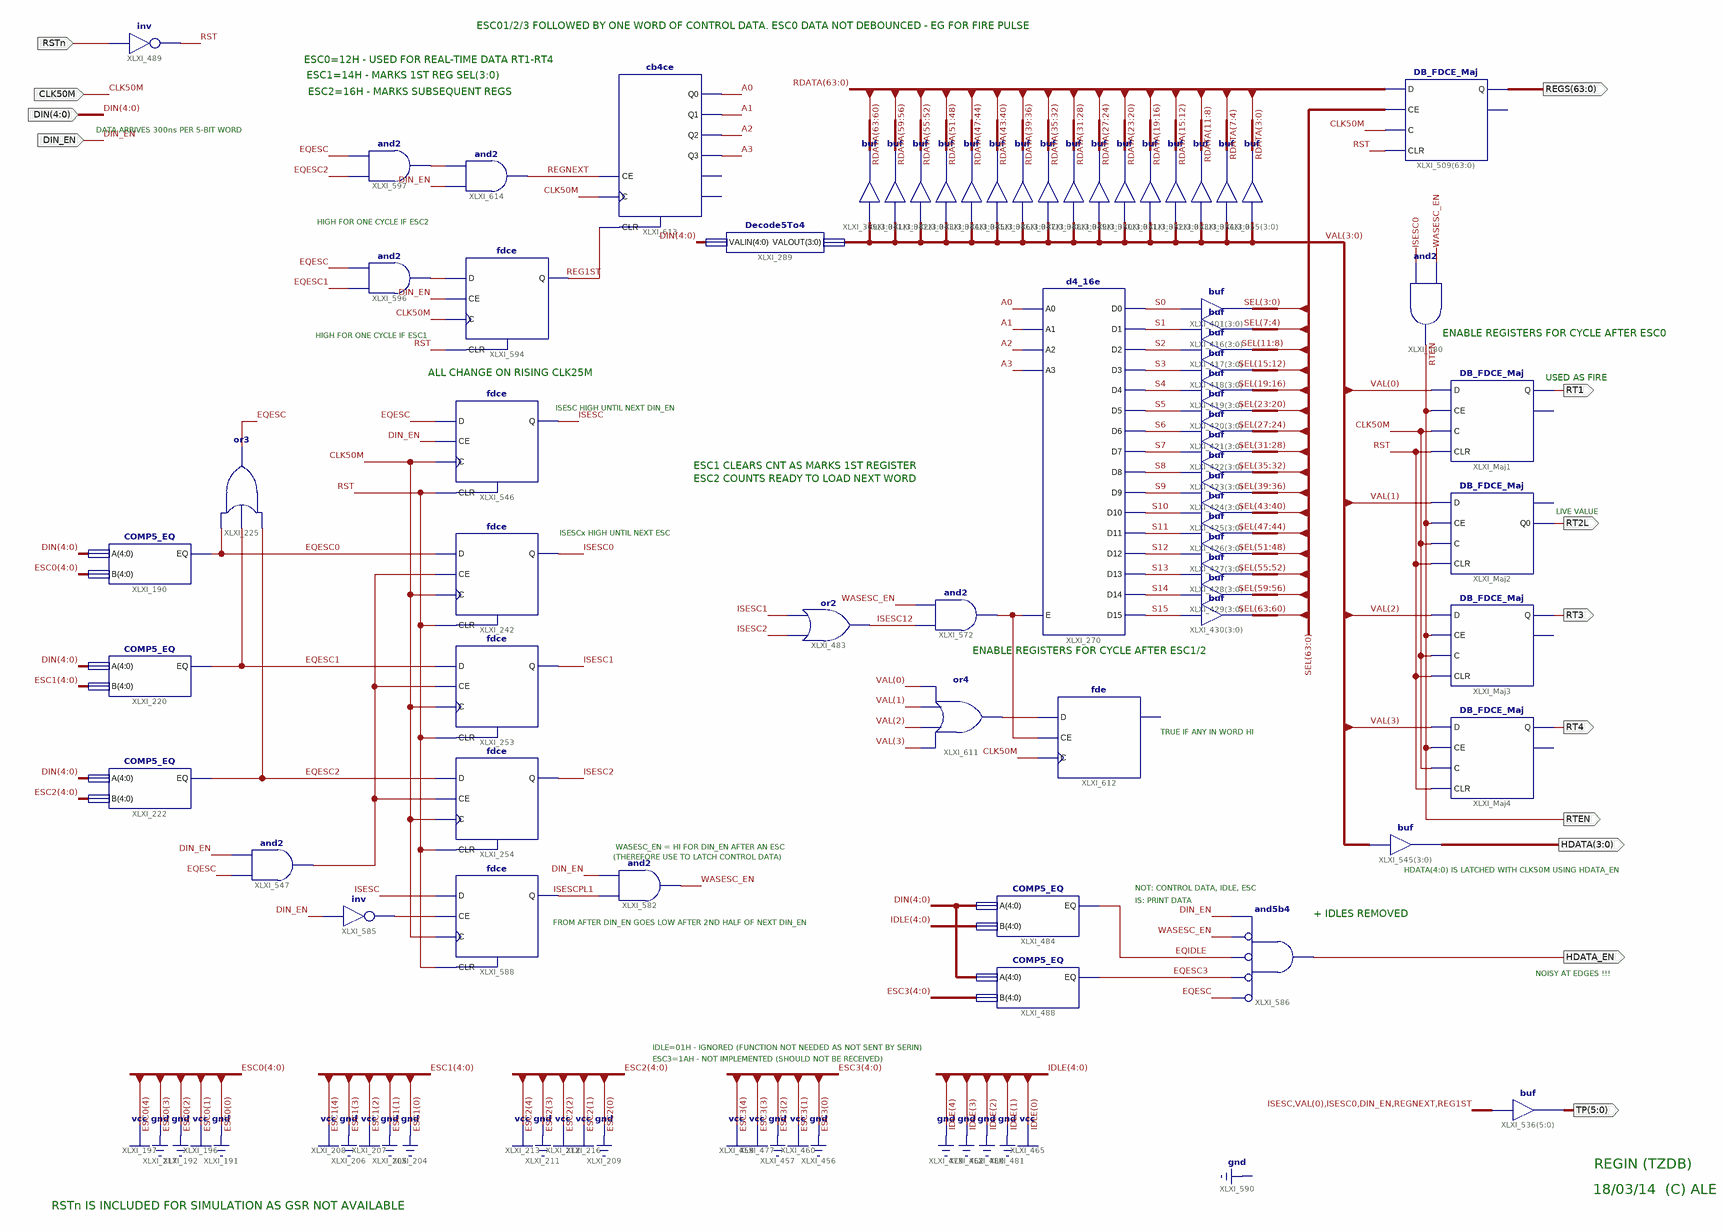
[diagram p0: schematic sheet 1]
// Xilinx ISE schematic DB_RegIn.sch (aspartan3e) as structural Verilog: 67 symbols, 13 ports
module DB_RegIn (
  input  CLK50M,
  input  [4:0] DIN,
  input  DIN_EN,
  input  RSTn,
  output [63:0] REGS,
  output RT1,
  output RT3,
  output RT4,
  output RTEN,
  output HDATA_EN,
  output [3:0] HDATA,
  output [5:0] TP,
  output RT2L
);

  wire A0, A1, A2, A3, EQESC, EQESC0, EQESC1, EQESC2, EQESC3, EQIDLE, ISESC, ISESC0, ISESC1, ISESC2, ISESC12,
       ISESCPL1, REG1ST, REGNEXT, RST, S0, S1, S2, S3, S4, S5, S6, S7, S8, S9, S10, S11, S12, S13, S14, S15,
       WASESC_EN, XLXN_833, XLXN_905, XLXN_906, XLXN_910, XLXN_955, XLXN_956;
  wire [3:0] VAL;
  wire [63:0] RDATA, SEL;

  COMP5_EQ XLXI_190 (.A(DIN), .B(5'b10010), .EQ(EQESC0));
  or XLXI_225 (EQESC, EQESC2, EQESC1, EQESC0);
  fdce XLXI_242 (.C(CLK50M), .CE(XLXN_833), .CLR(RST), .D(EQESC0), .Q(ISESC0));
  fdce XLXI_253 (.C(CLK50M), .CE(XLXN_833), .CLR(RST), .D(EQESC1), .Q(ISESC1));
  fdce XLXI_254 (.C(CLK50M), .CE(XLXN_833), .CLR(RST), .D(EQESC2), .Q(ISESC2));
  COMP5_EQ XLXI_220 (.A(DIN), .B(5'b10100), .EQ(EQESC1));
  COMP5_EQ XLXI_222 (.A(DIN), .B(5'b10110), .EQ(EQESC2));
  assign RDATA[63:60] = VAL;  // buf XLXI_309[3..0], 4 bits wide
  assign RDATA[59:56] = VAL;  // buf XLXI_341[3..0], 4 bits wide
  assign RDATA[55:52] = VAL;  // buf XLXI_342[3..0], 4 bits wide
  assign RDATA[51:48] = VAL;  // buf XLXI_343[3..0], 4 bits wide
  assign RDATA[47:44] = VAL;  // buf XLXI_344[3..0], 4 bits wide
  assign RDATA[43:40] = VAL;  // buf XLXI_345[3..0], 4 bits wide
  assign RDATA[39:36] = VAL;  // buf XLXI_346[3..0], 4 bits wide
  assign RDATA[35:32] = VAL;  // buf XLXI_347[3..0], 4 bits wide
  assign RDATA[31:28] = VAL;  // buf XLXI_348[3..0], 4 bits wide
  assign RDATA[27:24] = VAL;  // buf XLXI_349[3..0], 4 bits wide
  assign RDATA[23:20] = VAL;  // buf XLXI_350[3..0], 4 bits wide
  assign RDATA[19:16] = VAL;  // buf XLXI_351[3..0], 4 bits wide
  assign RDATA[15:12] = VAL;  // buf XLXI_352[3..0], 4 bits wide
  assign RDATA[11:8] = VAL;  // buf XLXI_353[3..0], 4 bits wide
  assign RDATA[7:4] = VAL;  // buf XLXI_354[3..0], 4 bits wide
  assign RDATA[3:0] = VAL;  // buf XLXI_355[3..0], 4 bits wide
  Decode5To4 XLXI_289 (.VALIN(DIN), .VALOUT(VAL));
  d4_16e XLXI_270 (
    .A0(A0), .A1(A1), .A2(A2), .A3(A3), .E(XLXN_955), .D0(S0), .D1(S1), .D10(S10), .D11(S11), .D12(S12),
    .D13(S13), .D14(S14), .D15(S15), .D2(S2), .D3(S3), .D4(S4), .D5(S5), .D6(S6), .D7(S7), .D8(S8), .D9(S9));
  assign SEL[3:0] = {4{S0}};  // buf XLXI_401[3..0], 4 bits wide
  assign SEL[7:4] = {4{S1}};  // buf XLXI_416[3..0], 4 bits wide
  assign SEL[11:8] = {4{S2}};  // buf XLXI_417[3..0], 4 bits wide
  assign SEL[15:12] = {4{S3}};  // buf XLXI_418[3..0], 4 bits wide
  assign SEL[19:16] = {4{S4}};  // buf XLXI_419[3..0], 4 bits wide
  assign SEL[23:20] = {4{S5}};  // buf XLXI_420[3..0], 4 bits wide
  assign SEL[27:24] = {4{S6}};  // buf XLXI_421[3..0], 4 bits wide
  assign SEL[31:28] = {4{S7}};  // buf XLXI_422[3..0], 4 bits wide
  assign SEL[35:32] = {4{S8}};  // buf XLXI_423[3..0], 4 bits wide
  assign SEL[39:36] = {4{S9}};  // buf XLXI_424[3..0], 4 bits wide
  assign SEL[43:40] = {4{S10}};  // buf XLXI_425[3..0], 4 bits wide
  assign SEL[47:44] = {4{S11}};  // buf XLXI_426[3..0], 4 bits wide
  assign SEL[51:48] = {4{S12}};  // buf XLXI_427[3..0], 4 bits wide
  assign SEL[55:52] = {4{S13}};  // buf XLXI_428[3..0], 4 bits wide
  assign SEL[59:56] = {4{S14}};  // buf XLXI_429[3..0], 4 bits wide
  assign SEL[63:60] = {4{S15}};  // buf XLXI_430[3..0], 4 bits wide
  DB_FDCE_Maj XLXI_Maj1 (.C(CLK50M), .CE(RTEN), .CLR(RST), .D(VAL[0]), .Q(RT1));  // open: Q0
  DB_FDCE_Maj XLXI_509[63:0] (.C(CLK50M), .CE(SEL), .CLR(RST), .D(RDATA), .Q(REGS));  // open: Q0
  DB_FDCE_Maj XLXI_Maj3 (.C(CLK50M), .CE(RTEN), .CLR(RST), .D(VAL[2]), .Q(RT3));  // open: Q0
  DB_FDCE_Maj XLXI_Maj4 (.C(CLK50M), .CE(RTEN), .CLR(RST), .D(VAL[3]), .Q(RT4));  // open: Q0
  assign HDATA = VAL;  // buf XLXI_545[3..0], 4 bits wide
  fdce XLXI_546 (.C(CLK50M), .CE(DIN_EN), .CLR(RST), .D(EQESC), .Q(ISESC));
  and XLXI_547 (XLXN_833, EQESC, DIN_EN);
  COMP5_EQ XLXI_484 (.A(DIN), .B(5'b00001), .EQ(EQIDLE));
  COMP5_EQ XLXI_488 (.A(DIN), .B(5'b11010), .EQ(EQESC3));
  assign TP = {ISESC, VAL[0], ISESC0, DIN_EN, REGNEXT, REG1ST};  // buf XLXI_536[5..0], 6 bits wide
  and XLXI_580 (RTEN, ISESC0, WASESC_EN);
  and XLXI_582 (WASESC_EN, ISESCPL1, DIN_EN);
  not XLXI_585 (XLXN_905, DIN_EN);
  and XLXI_586 (HDATA_EN, ~EQESC, ~EQESC3, ~EQIDLE, ~WASESC_EN, DIN_EN);  // and5b4
  fdce XLXI_588 (.C(CLK50M), .CE(XLXN_905), .CLR(RST), .D(ISESC), .Q(ISESCPL1));
  and XLXI_596 (XLXN_906, EQESC1, EQESC);
  fdce XLXI_594 (.C(CLK50M), .CE(DIN_EN), .CLR(RST), .D(XLXN_906), .Q(REG1ST));
  and XLXI_597 (XLXN_910, EQESC2, EQESC);
  and XLXI_572 (XLXN_955, ISESC12, WASESC_EN);
  or XLXI_483 (ISESC12, ISESC2, ISESC1);
  or XLXI_611 (XLXN_956, VAL[3], VAL[2], VAL[1], VAL[0]);
  fde XLXI_612 (.C(CLK50M), .CE(XLXN_955), .D(XLXN_956));  // open: Q
  not XLXI_489 (RST, RSTn);
  and XLXI_614 (REGNEXT, DIN_EN, XLXN_910);
  cb4ce XLXI_613 (.C(CLK50M), .CE(REGNEXT), .CLR(REG1ST), .Q0(A0), .Q1(A1), .Q2(A2), .Q3(A3));  // open: CEO, TC
  DB_FDCE_Maj XLXI_Maj2 (.C(CLK50M), .CE(RTEN), .CLR(RST), .D(VAL[1]), .Q0(RT2L));  // open: Q

  // Notes on the sheet:
  //   ESC01/2/3 FOLLOWED BY ONE WORD OF CONTROL DATA. ESC0 DATA NOT DEBOUNCED - EG FOR FIRE PULSE
  //   ESC0=12H - USED FOR REAL-TIME DATA RT1-RT4
  //   ESC1=14H - MARKS 1ST REG SEL(3:0)
  //   ESC2=16H - MARKS SUBSEQUENT REGS
  //   DATA ARRIVES 300ns PER 5-BIT WORD
  //   HIGH FOR ONE CYCLE IF ESC2
  //   ENABLE REGISTERS FOR CYCLE AFTER ESC0
  //   HIGH FOR ONE CYCLE IF ESC1
  //   ALL CHANGE ON RISING CLK25M
  //   USED AS FIRE
  //   ISESC HIGH UNTIL NEXT DIN_EN
  //   ESC1 CLEARS CNT AS MARKS 1ST REGISTER
  //   ESC2 COUNTS READY TO LOAD NEXT WORD
  //   LIVE VALUE
  //   ISESCx HIGH UNTIL NEXT ESC
  //   ENABLE REGISTERS FOR CYCLE AFTER ESC1/2
  //   TRUE IF ANY IN WORD HI
  //   WASESC_EN = HI FOR DIN_EN AFTER AN ESC
  //   (THEREFORE USE TO LATCH CONTROL DATA)
  //   HDATA(4:0) IS LATCHED WITH CLK50M USING HDATA_EN
  //   NOT: CONTROL DATA, IDLE, ESC
  //   IS: PRINT DATA
  //   + IDLES REMOVED
  //   FROM AFTER DIN_EN GOES LOW AFTER 2ND HALF OF NEXT DIN_EN
  //   NOISY AT EDGES !!!
  //   IDLE=01H - IGNORED (FUNCTION NOT NEEDED AS NOT SENT BY SERIN)
  //   ESC3=1AH - NOT IMPLEMENTED (SHOULD NOT BE RECEIVED)
  //   REGIN (TZDB)
  //   18/03/14  (C) ALE
  //   RSTn IS INCLUDED FOR SIMULATION AS GSR NOT AVAILABLE
endmodule
